# EAGLE schematic garden_box (EAGLE 9.0.0)
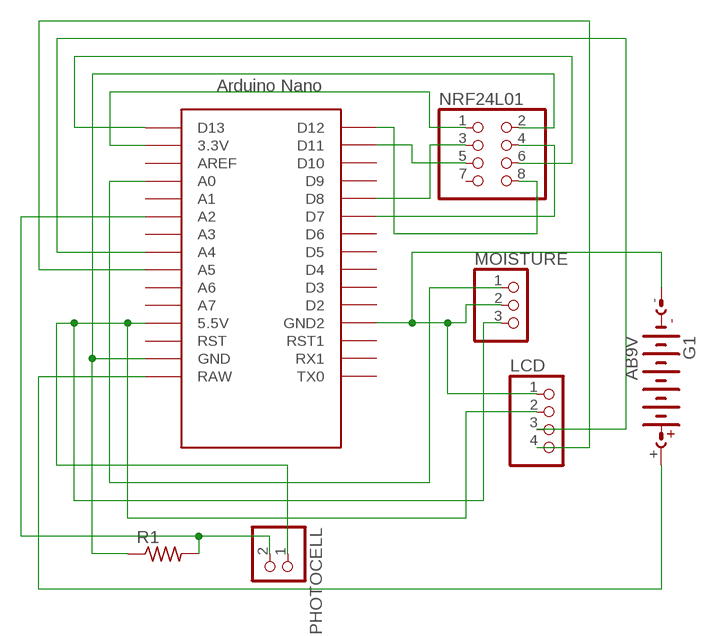
[diagram p0: schematic, sheet 1]

## Parts
G1  AB9V  [AB9V]
LCD  PINHD-1X4  [1X04]
MOISTURE  PINHD-1X3  [1X03]
NRF24L01  PINHD-2X4  [2X04]
PHOTOCELL  PINHD-1X2  [1X02]
R1  R-US_0204/7  [0204/7]
U$1  NANO  [NANO]

## Nets
N$1: NRF24L01.1 U$1.3.3V
N$2: NRF24L01.2 R1.1 U$1.GND
N$3: NRF24L01.3 U$1.D8
N$4: NRF24L01.4 U$1.D7
N$5: NRF24L01.5 U$1.D11
N$6: NRF24L01.6 U$1.D13
N$7: NRF24L01.8 U$1.D12
N$8: MOISTURE.1 U$1.A0
N$9: G1.- LCD.1 MOISTURE.2 U$1.GND1(GND2)
N$10: G1.+ U$1.RAW
N$11: LCD.2 MOISTURE.3 PHOTOCELL.1 U$1.5V(5.5V)
N$13: LCD.3 U$1.A4
N$14: LCD.4 U$1.A5
N$16: PHOTOCELL.2 R1.2 U$1.A2
Unconnected: NRF24L01.7 U$1.A1 U$1.A3 U$1.A6 U$1.A7 U$1.AREF U$1.D2 U$1.D3 U$1.D4 U$1.D5 U$1.D6 U$1.D9 U$1.D10 U$1.ICSP1 U$1.ICSP2 U$1.ICSP3 U$1.ICSP4 U$1.ICSP5 U$1.ICSP6 U$1.RST U$1.RST1 U$1.RX1 U$1.TX0

## Library data of the parts
G1 = battery:AB9V: 9-V BATTERY CLIP
LCD = pinhead:PINHD-1X4: PIN HEADER
MOISTURE = pinhead:PINHD-1X3: PIN HEADER
NRF24L01 = pinhead:PINHD-2X4: PIN HEADER
PHOTOCELL = pinhead:PINHD-1X2: PIN HEADER
R1 = adafruit:R-US_: RESISTOR, American symbol
U$1 = Arduino-clone:NANO: Arduino Nano